# Altium project openEPS.PrjPcb (part 3 of 5)

## Sheet TPS53319 5.0V Buck Converter.SchDoc
size Letter; Organization: Altium Limited; Address1: L3, 12a Rodborough Rd; Address2: Frenchs Forest; Address3: NSW; Address4: Australia 2086; CopyrightYear: 2019
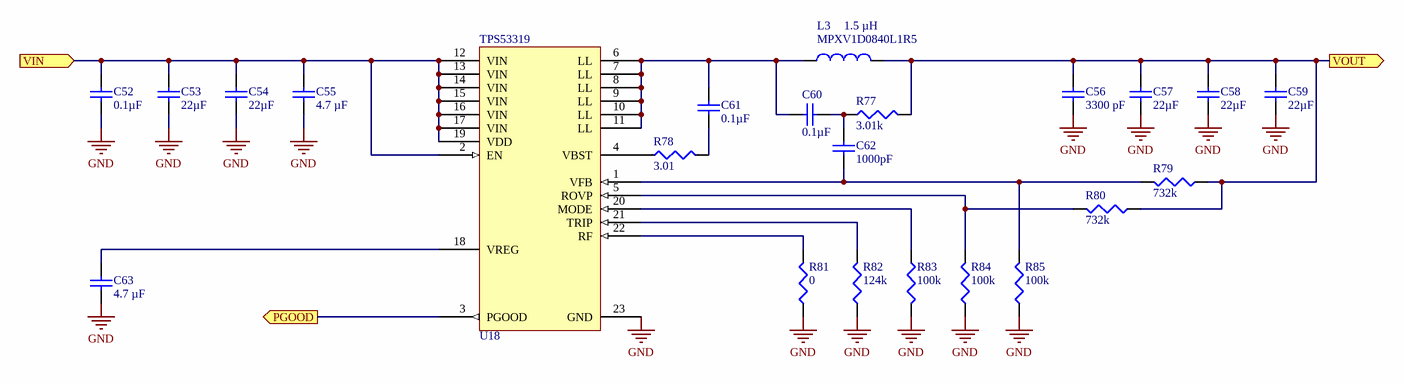
[diagram p10: TPS53319 5.0V Buck Converter.SchDoc]

### Parts
C52  value 0.1µF  [TY-TWK107]  (hidden comment: Cap)
C53  value 22µF  [TDK-C3225]  (hidden comment: Cap)
C54  value 22µF  [TDK-C3225]  (hidden comment: Cap)
C55  value 4.7 µF  [MUR-GRM188]  (hidden comment: Cap)
C56  value 3300 pF  [KEM-0402BB]  (hidden comment: Cap)
C57  value 22µF  [TDK-C3225]  (hidden comment: Cap)
C58  value 22µF  [TDK-C3225]  (hidden comment: Cap)
C59  value 22µF  [TDK-C3225]  (hidden comment: Cap)
C60  value 0.1µF  [TY-TWK107]  (hidden comment: Cap)
C61  value 0.1µF  [TY-TWK107]  (hidden comment: Cap)
C62  value 1000pF  [TDK-CGA2B]  (hidden comment: Cap)
C63  value 4.7 µF  [MUR-GRM188]  (hidden comment: Cap)
L3  value 1.5 µH  Manufacturer Part Number: MPXV1D0840L1R5  [KEM-MPXV1D0840]  (hidden comment: Inductor)
R77  value 3.01k  [VSH-CRCW0201]  (hidden comment: Res3)
R78  value 3.01  [VSH-CRCW0201]  (hidden comment: Res3)
R79  value 732k  [PANA-ERJ2R]  (hidden comment: Res3)
R80  value 732k  [PANA-ERJ2R]  (hidden comment: Res3)
R81  value 0  [PANA-ERJ2G]  (hidden comment: Jumper)
R82  value 124k  [PANA-ERJ2R]  (hidden comment: Res3)
R83  value 100k  [PANA-ERJ2R]  (hidden comment: Res3)
R84  value 100k  [PANA-ERJ2R]  (hidden comment: Res3)
R85  value 100k  [PANA-ERJ2R]  (hidden comment: Res3)
U18  TPS53319  [TI-R-PSON-N22]

### Ports
PGOOD (out), VIN (in), VOUT (out)

### Nets
GND: C52.1 C53.1 C54.1 C55.1 C56.1 C57.1 C58.1 C59.1 C63.1 R81.1 R82.1 R83.1 R84.1 R85.1 U18.23(GND)
VBATT_BUS: C52.2 C53.2 C54.2 C55.2 U18.2(EN) U18.12(VIN) U18.13(VIN) U18.14(VIN) U18.15(VIN) U18.16(VIN) U18.17(VIN) U18.19(VDD) ; port VIN
NetC56_2: C56.2 C57.2 C58.2 C59.2 L3.2 R77.2 R79.1 R80.1 ; port VOUT
NetC60_1: C60.1 C62.1 R77.1
NetC60_2: C60.2 C61.2 L3.1 U18.6(LL) U18.7(LL) U18.8(LL) U18.9(LL) U18.10(LL) U18.11(LL)
NetC61_1: C61.1 R78.2
NetC62_2: C62.2 R79.2 R85.2 U18.1(VFB)
NetC63_2: C63.2 U18.18(VREG)
NetR52_1: U18.3(PGOOD) ; port PGOOD
NetR78_1: R78.1 U18.4(VBST)
NetR80_2: R80.2 R84.2 U18.5(ROVP)
NetR81_2: R81.2 U18.22(RF)
NetR82_2: R82.2 U18.21(TRIP)
NetR83_2: R83.2 U18.20(MODE)

### Notes on the sheet
- (the "License"); you may not use or redistribute this file except in compliance with the License. You
- This file and the information within it are licensed under the terms of the Apache License, Version 2.0
- Copyright
- Unless required by applicable law or agreed to in writing, content distributed under the License is
- distributed on an "AS IS" BASIS, WITHOUT WARRANTIES OR CONDITIONS OF ANY KIND,
- either express or implied. See the License for the specific language governing permissions and
- limitations under the License.
- may obtain a copy of the License at:
- http://www.apache.org/licenses/LICENSE-2.0
- Title
- Size:
- Date:
- Letter
- Number:
- Time:
- Revision:
- Sheet
- of
- University of Alberta
- Deptartment of Electrical
- and Computer Engineering
- Edmonton AB, Canada
- T6G 1H9
- File:

### Library data of the parts
C52 C60 C61 = PC-TY-00817: CAP CER 0.1UF 25V X7R 0306; Manufacturer Part Number: TWK107B7104MVHT; Index: 817; Designator: C?; Tolerance: ±20%; Published: 2022-12-10; LatestRevisionDate: 2022-12-10; LatestRevisionNote: ...; PackageReference: 0306 (0816 Metric); Publisher: AlbertaSat; PackageDescription: Chip Capacitor, 2-Leads, Body 0.80x1.60mm, IPC Low Density; Part Number: PC-TY-00817; Supplier Part Number 1: 587-6181-1-ND; Supplier 1: Digi-key; Supplier Part Number 2: 963-TWK107B7104MVHT; Supplier 2: Mouser; Supplier Link: #https://www.digikey.ca/en/products/detail/taiyo-yuden/TWK107B7104MVHT/7403736#; Voltage-Rated: 25V; Temperature Coefficient: X7R; Application: Automotive; Operating Temperature: -55°C ~ 125°C
C53 C54 C57-C59 = PC-TDK-02965: CAP CER 22UF 25V X7R 1210; Manufacturer Part Number: C3225X7R1E226M250AB; Index: 2965; Designator: C?; Tolerance: ±20%; Code_IEC: 3225; Published: 2022-10-26; LatestRevisionDate: 2022-10-26; LatestRevisionNote: ...; PackageReference: 1210 (3225 Metric); Publisher: AlbertaSat; PackageDescription: Chip Capacitor, 2-Leads, Body 3.20x2.50mm, IPC Low Density; Part Number: PC-TDK-02965; Supplier Part Number 1: 445-181602-1-ND; Supplier 1: Digi-key; Supplier Part Number 2: 810-C3225X7R1EM250AB; Supplier 2: Mouser; Supplier Link: #https://www.digikey.ca/en/products/detail/tdk-corporation/C3225X7R1E226M250AB/9991387#; Voltage - Rated: 25V; Temperature Coefficient: X7R; Applications: General Purpose; Code_JEITA: 1210; Operating Temperature: -55°C ~ 125°C
C55 C63 = 10165: CAP CER 4.7UF 16V X7R 0603; Part Number: 10165; Manufacturer Part Number: GRM188Z71C475KE21D; Designator: C?; Tolerance: ±10%; Voltage - Rated: 25V; Published: 8-Jun-2000; LatestRevisionDate: 17-Jul-2002; LatestRevisionNote: Re-released for DXP Platform.; PackageReference: 0603 (1608 Metric); Publisher: Altium Limited; PackageDescription: Chip Capacitor, 2-Leads, Body 1.60x0.80mm, IPC Low Density; Supplier Part Number 1: 490-GRM188Z71C475KE21DCT-ND; Supplier 1: Digi-Key; Supplier Link: #https://www.digikey.ca/en/products/detail/murata-electronics/GRM188Z71C475KE21D/13401930#; Temperature Coefficient: X7R; Application: General Purpose; Operating Temperature: -55°C ~ 125°C; Supplier 2: Mouser; Supplier Part Number 2: 81-GRM188Z71C475KE1D
C56 = PC-KEM-03166: CAP CER 3300PF 50V X7R 0402; Manufacturer Part Number: C0402C332K5RAC7867; Index: 3166; Designator: C?; Tolerance: ±10%; Published: 2022-10-26; LatestRevisionDate: 2023-05-04; LatestRevisionNote: Added operating temperature; PackageReference: 0402 (1005 Metric); Publisher: AlbertaSat; PackageDescription: Chip Capacitor, 2-Leads, Body 1.00x0.50mm, IPC Low Density; Part Number: PC-KEM-03166; Supplier Part Number 1: 399-C0402C332K5RAC7867CT-ND; Supplier 1: Digi-key; Supplier Part Number 2: 80-C0402C332K5RAC; Supplier 2: Mouser; Supplier Link: #https://www.digikey.ca/en/products/detail/kemet/C0402C332K5RAC7867/501972?s=N4IgTCBcDaIMwE4EFoDCAGALOsq5zAGkBWAJQEFUB2ADgDYrUAVZAOQBEQBdAXyA#; Voltage - Rated: 50V; Temperature Coefficient: X7R; Applications: Bypass, Decoupling; Operating Temperature: -55°C ~ 125°C
C62 = PC-TDK-01454: CAP CER 1000PF 100V C0G 0402; Manufacturer Part Number: CGA2B1C0G2A102J050BC; Index: 1454; Designator: C?; Tolerance: ±5%; Temperature Coefficient: NP0; Published: 2016-03-16; LatestRevisionDate: 2016-03-16; LatestRevisionNote: ...; PackageReference: 0402 (1005 Metric); Publisher: AlbertaSat; PackageDescription: Radial Cap, Thru-Hole; 2 Leads; 0.3 in Pin Spacing; Part Number: PC-TDK-01454; Supplier Part Number 1: 445-172682-1-ND; Supplier 1: Digi-key; Supplier Link: http://www.digikey.ca/product-search/en?keywords=445-172682-1-ND; Voltage - Rated: 100V; Applications: Automotive; Operating Temperature: -55°C ~ 125°C
L3 = PL-KEM-03165: FIXED IND 1.5UH 16.2A 6.8MOHM SM; Code_IEC: 1005; Index: 3165; Designator: L?; Tolerance: ±20%; Published: 2022-10-26; LatestRevisionDate: 2023-05-04; LatestRevisionNote: Added operating temperature; PackageReference: 0.341" L x 0.315" W (8.65mm x 8.00mm); Publisher: AlbertaSat; PackageDescription: Precision Wire Wound Inductor, 2-Leads, Body 8.65x8.00mm, IPC Low Density; Code_JEITA: 0402; Part Number: PL-KEM-03165; Supplier Part Number 1: 399-MPXV1D0840L1R5CT-ND; Supplier 1: Digi-key; Supplier Part Number 2: 80-MPXV1D0840L1R5; Supplier 2: Mouser; Supplier Link: #https://www.digikey.ca/en/products/detail/kemet/MPXV1D0840L1R5/11314594?s=N4IgTCBcDaILIAUAaA1AjAEQAwA4AsWAMmgEoCsIAugL5A#; Operating Temperature: -55°C ~ 155°C
R77 = PR-VSH-00325: RES SMD 3.01K OHM 1% 1/20W 0201; Manufacturer Part Number: CRCW02013K01FKED; Index: 325; Designator: R?; Power - Rated: 0.05W, 1/20W; Temperature Coefficient: ±100ppm/°C; Published: 2022-12-11; LatestRevisionDate: 2022-12-11; LatestRevisionNote: ...; PackageReference: 0201 (0603 Metric); Publisher: AlbertaSat; PackageDescription: Chip Resistor, 2-Leads, Body 0.60x0.30mm, IPC Low Density; Part Number: PR-VSH-00325; Supplier Part Number 1: 541-3.01KAABCT-ND; Supplier 1: Digi-key; Supplier Part Number 2: 71-CRCW02013K01FKED; Supplier 2: Mouser; Supplier Link: #https://www.digikey.ca/en/products/detail/vishay-dale/CRCW02013K01FKED/1968056#; Tolerance: ±1%; Operating Temperature: -55°C ~ 155°C
R78 = PR-VSH-00326: CRCW0201 - 200/+400 3R01 1% ET7; Manufacturer Part Number: CRCW02013R01FXED; Index: 326; Designator: R?; Power - Rated: 0.05W, 1/20W; Temperature Coefficient: -200/ +400ppm/°C; Published: 2022-12-11; LatestRevisionDate: 2022-12-11; LatestRevisionNote: ...; PackageReference: 0201 (0603 Metric); Publisher: AlbertaSat; PackageDescription: Chip Resistor, 2-Leads, Body 0.60x0.30mm, IPC Low Density; Part Number: PR-VSH-00326; Supplier Part Number 1: 541-CRCW02013R01FXEDCT-ND; Supplier 1: Digi-key; Supplier Part Number 2: CRCW02013R01FXED; Supplier 2: Avnet; Supplier Link: #https://www.digikey.ca/en/products/detail/vishay-dale/CRCW02013R01FXED/10458991#; Tolerance: ±1%; Operating Temperature: -55°C ~ 155°C
R79 R80 = 19585: RES SMD 732K OHM 1% 1/10W 0402; Part Number: 19585; Manufacturer Part Number: ERJ-2RKF7323X; Designator: R?; Power: 0.1W, 1/10W; Temperature Coefficient: ±100ppm/°C; Published: 8-Jun-2000; LatestRevisionDate: 29-May-2009; LatestRevisionNote: IPC-7351 Footprint Added.; PackageReference: 0402 (1005 Metric); Publisher: Altium Limited; PackageDescription: Chip Resistor, 2-Leads, Body 1.00x0.50mm, IPC Low Density; Supplier Part Number 1: P732KLCT-ND; Supplier 1: Digi-Key; Supplier Link: http://www.digikey.ca/product-search/en?keywords=P732KLCT-ND; Tolerance: ±1%; Operating Temperature: -55°C ~ 155°C
R81 = 13127: RES SMD 0.0OHM JUMPER 1/10W 0402; Part Number: 13127; Manufacturer Part Number: ERJ-2GE0R00X; Designator: R?; Power: 0.1W, 1/10W; PackageDescription: Chip Resistor, 2-Leads, Body 1.00x0.50mm, IPC Low Density; Supplier Part Number 1: P0.0JCT-ND; Supplier 1: Digi-Key; Supplier Link: http://www.digikey.ca/product-search/en?keywords=P0.0JCT-ND; PackageReference: 0402 (1005 Metric); Tolerance: Jumper; Temperature Coefficient: -; Type: Jumper; Operating Temperature: -55°C ~ 155°C; Supplier 2: Mouser; Supplier Part Number 2: 667-ERJ-2GE0R00X
R82 = 18840: RES SMD 124K OHM 1% 1/10W 0402; Part Number: 18840; Manufacturer Part Number: ERJ-2RKF1243X; Designator: R?; Power: 0.1W, 1/10W; Temperature Coefficient: ±100ppm/°C; Published: 8-Jun-2000; LatestRevisionDate: 29-May-2009; LatestRevisionNote: IPC-7351 Footprint Added.; PackageReference: 0402 (1005 Metric); Publisher: Altium Limited; PackageDescription: Chip Resistor, 2-Leads, Body 1.00x0.50mm, IPC Low Density; Supplier Part Number 1: P124KLCT-ND; Supplier 1: Digi-Key; Supplier Link: http://www.digikey.ca/product-search/en?keywords=P124KLCT-ND; Tolerance: ±1%; Operating Temperature: -55°C ~ 155°C
R83-R85 = 18739: as R74-R76 on sheet TPS53319 3.3V Buck Converter; Published: 8-Jun-2000; LatestRevisionDate: 29-May-2009; LatestRevisionNote: IPC-7351 Footprint Added.; PackageReference: 0402 (1005 Metric); Publisher: Altium Limited; PackageDescription: Chip Resistor, 2-Leads, Body 1.00x0.50mm, IPC Low Density; Supplier Part Number 1: P100KLCT-ND; Supplier 1: Digi-Key; Supplier Link: http://www.digikey.ca/product-search/en?keywords=P100KLCT-ND; Tolerance: ±1%; Operating Temperature: -55°C ~ 155°C
U18 = 145: IC REG BUCK ADJUSTABLE 14A 22SON; Part Number: 145; Designator: U?; Supplier Part Number 2: 595-TPS53319DQPT; Supplier 2: Mouser; Manufacturer Part Number: TPS53319DQPT; Supplier Part Number 1: 296-39410-1-ND; Supplier 1: Digi-Key; Supplier Link: #https://www.digikey.ca/en/products/detail/texas-instruments/TPS53319DQPT/3471186#; PackageReference: TI-R-PSON-N22; Operating Temperature: -40°C ~ 85°C (TA)

## Sheet MAX16998A Watchdog Circuit.SchDoc: Watchdog Circuit
size Letter; SheetNumber: 15
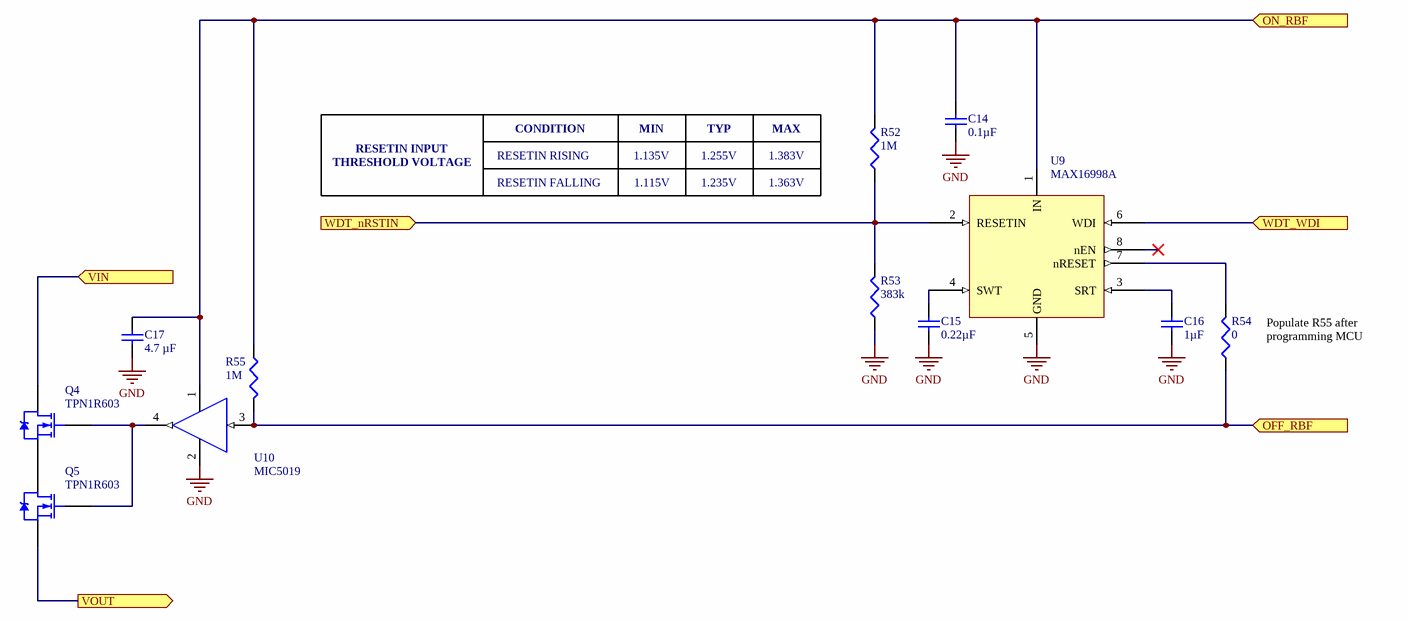
[diagram p11: MAX16998A Watchdog Circuit.SchDoc]

### Parts
C14  value 0.1µF  [TDK-CGA2B]  (hidden comment: Cap)
C15  value 0.22µF  [TDK-CGA3E]  (hidden comment: Cap)
C16  value 1µF  [TY-0603A]  (hidden comment: Cap)
C17  value 4.7 µF  [MUR-GRM188]  (hidden comment: Cap)
Q4  TPN1R603  [TOSH-S-3X1S]
Q5  TPN1R603  [TOSH-S-3X1S]
R52  value 1M  [PANA-ERJ2R]  (hidden comment: Res3)
R53  value 383k  [PANA-ERJ2R]  (hidden comment: Res3)
R54  value 0  [PANA-ERJ2G]  (hidden comment: Jumper)
R55  value 1M  [PANA-ERJ2R]  (hidden comment: Res3)
U9  MAX16998A  [MAX-21-0036]
U10  MIC5019  [MCP-MIC5019]

### Ports
OFF_RBF (in), ON_RBF (in), VIN (in), VOUT (out), WDT_nRSTIN (in), WDT_WDI (in)

### Nets
GND: C14.2 C15.1 C16.1 C17.1 R53.1 U9.5(GND) U10.2(GND)
VBATT: Q4.2(D) ; port VIN
VBATT_SWITCHED: Q5.3(S) ; port VOUT
GIO1: U9.6(WDI) ; port WDT_WDI
RBF_ALWAYSOFF: R54.1 R55.1 U10.3(IN) ; port OFF_RBF
RBF_ALWAYSON: C14.1 C17.2 R52.2 R55.2 U9.1(IN) U10.1(VDD) ; port ON_RBF
NetC15_2: C15.2 U9.4(SWT)
NetC16_2: C16.2 U9.3(SRT)
NetQ4_1: Q4.1(G) Q5.1(G) U10.4(OUT)
NetQ4_3: Q4.3(S) Q5.2(D)
NetR52_1: R52.1 R53.2 U9.2(RESETIN) ; port WDT_nRSTIN
NetR54_2: R54.2 U9.7(nRESET)

Not connected (* = marked no-connect by the designer): U9 8(nEN)*

### Notes on the sheet
- RESETIN INPUT
- THRESHOLD VOLTAGE
- RESETIN RISING
- CONDITION
- MIN
- 1.135V
- TYP
- 1.255V
- MAX
- 1.383V
- RESETIN FALLING
- 1.115V
- 1.235V
- 1.363V
- (near R54) Populate R55 after
- (near R54) programming MCU
- (the "License"); you may not use or redistribute this file except in compliance with the License. You
- This file and the information within it are licensed under the terms of the Apache License, Version 2.0
- Copyright
- Unless required by applicable law or agreed to in writing, content distributed under the License is
- distributed on an "AS IS" BASIS, WITHOUT WARRANTIES OR CONDITIONS OF ANY KIND,
- either express or implied. See the License for the specific language governing permissions and
- limitations under the License.
- may obtain a copy of the License at:
- http://www.apache.org/licenses/LICENSE-2.0
- Title
- Size:
- Date:
- Letter
- Number:
- Time:
- Revision:
- Sheet
- of
- University of Alberta
- Deptartment of Electrical
- and Computer Engineering
- Edmonton AB, Canada
- T6G 1H9
- File:

### Library data of the parts
C14 = PC-TDK-02259: CAP CER 0.1UF 50V X7R 0402; Manufacturer Part Number: CGA2B3X7R1H104K050BB; Index: 2259; Designator: C?; Tolerance: ±10%; Published: 2016-03-16; LatestRevisionDate: 2016-03-16; LatestRevisionNote: ...; PackageReference: 0402 (1005 Metric); Publisher: AlbertaSat; PackageDescription: Radial Cap, Thru-Hole; 2 Leads; 0.3 in Pin Spacing; Part Number: PC-TDK-02259; Supplier Part Number 1: 445-6899-1-ND; Supplier 1: Digi-key; Supplier Link: http://www.digikey.ca/product-search/en?keywords=445-6899-1-ND; Voltage - Rated: 50V; Temperature Coefficient: X7R; Applications: Automotive; Operating Temperature: -55°C ~ 125°C
C15 = PC-TDK-02393: CAP CER 0.22UF 50V X7R 0603; Manufacturer Part Number: CGA3E3X7R1H224K080AB; Index: 2393; Designator: C?; Tolerance: ±10%; Published: 2016-03-16; LatestRevisionDate: 2016-03-16; LatestRevisionNote: ...; PackageReference: 0603 (1608 Metric); Publisher: AlbertaSat; PackageDescription: Radial Cap, Thru-Hole; 2 Leads; 0.3 in Pin Spacing; Part Number: PC-TDK-02393; Supplier Part Number 1: 445-6926-1-ND; Supplier 1: Digi-key; Supplier Link: http://www.digikey.ca/product-search/en?keywords=445-6926-1-ND; Voltage - Rated: 50V; Temperature Coefficient: X7R; Applications: Automotive; Operating Temperature: -55°C ~ 125°C
C16 = PC-TY-00404: CAP CER 1UF 50V X7R 0603; Manufacturer Part Number: UMK107AB7105KA-T; Index: 404; Designator: C?; Tolerance: ±10%; Published: 2016-03-13; LatestRevisionDate: 2016-03-13; LatestRevisionNote: ...; PackageReference: 0603 (1608 Metric); Publisher: AlbertaSat; PackageDescription: Chip Capacitor, 2-Leads, Body 1.60x0.80mm, IPC Low Density; Part Number: PC-TY-00404; Supplier Part Number 1: 587-3247-1-ND; Supplier 1: Digi-key; Supplier Link: http://www.digikey.ca/product-search/en?keywords=587-3247-1-ND; Voltage-Rated: 50V; Temperature Coefficient: X7R; Application: General Purpose; Operating Temperature: -55°C ~ 125°C
C17 = 10165: as C55 on sheet TPS53319 5.0V Buck Converter; Published: 8-Jun-2000; LatestRevisionDate: 17-Jul-2002; LatestRevisionNote: Re-released for DXP Platform.; PackageReference: 0603 (1608 Metric); Publisher: Altium Limited; PackageDescription: Chip Capacitor, 2-Leads, Body 1.60x0.80mm, IPC Low Density; Supplier Part Number 1: 490-GRM188Z71C475KE21DCT-ND; Supplier 1: Digi-Key; Supplier Link: #https://www.digikey.ca/en/products/detail/murata-electronics/GRM188Z71C475KE21D/13401930#; Temperature Coefficient: X7R; Application: General Purpose; Operating Temperature: -55°C ~ 125°C; Supplier 2: Mouser; Supplier Part Number 2: 81-GRM188Z71C475KE1D
Q4 Q5 = PU-TOSH-00002: X35 PB-F POWER MOSFET TRANSISTOR; Index: 2; Designator: Q?; Rds On: 1.6mOhm @ 40A, 10V; Part Number: PU-TOSH-00002; Manufacturer Part Number: TPN1R603PL,L1Q; Supplier Part Number 1: TPN1R603PLL1QCT-ND; Supplier 1: Digi-key; Supplier Part Number 2: 757-TPN1R603PLL1Q; Supplier 2: Mouser; Publisher: AlbertaSat; Published: 2020-04-01; LatestRevisionDate: 2020-04-01; LatestRevisionNote: ...; PackageReference: 8-TSON Advance (3.3x3.3); PackageDescription: SON, 8-Leads, Body 3.10x3.10mm, Pitch 0.65mm, Thermal Pad 2.49x2.06mm, IPC Low Density; Supplier Link: #https://www.digikey.ca/product-detail/en/toshiba-semiconductor-and-storage/TPN1R603PL-L1Q/TPN1R603PLL1QCT-ND/6570930#; Operating Temperature: -55°C ~ 175°C (TJ)
R52 R55 = 19704: RES SMD 1M OHM 1% 1/10W 0402; Part Number: 19704; Manufacturer Part Number: ERJ-2RKF1004X; Designator: R?; Power: 0.1W, 1/10W; Temperature Coefficient: ±100ppm/°C; Published: 8-Jun-2000; LatestRevisionDate: 29-May-2009; LatestRevisionNote: IPC-7351 Footprint Added.; PackageReference: 0402 (1005 Metric); Publisher: Altium Limited; PackageDescription: Chip Resistor, 2-Leads, Body 1.00x0.50mm, IPC Low Density; Supplier Part Number 1: P1.00MLCT-ND; Supplier 1: Digi-Key; Supplier Link: http://www.digikey.ca/product-search/en?keywords=P1.00MLCT-ND; Tolerance: ±1%; Operating Temperature: -55°C ~ 155°C
R53 = 19322: RES SMD 383K OHM 1% 1/10W 0402; Part Number: 19322; Manufacturer Part Number: ERJ-2RKF3833X; Designator: R?; Power: 0.1W, 1/10W; Temperature Coefficient: ±100ppm/°C; Published: 8-Jun-2000; LatestRevisionDate: 29-May-2009; LatestRevisionNote: IPC-7351 Footprint Added.; PackageReference: 0402 (1005 Metric); Publisher: Altium Limited; PackageDescription: Chip Resistor, 2-Leads, Body 1.00x0.50mm, IPC Low Density; Supplier Part Number 1: P383KLCT-ND; Supplier 1: Digi-Key; Supplier Link: http://www.digikey.ca/product-search/en?keywords=P383KLCT-ND; Tolerance: ±1%; Operating Temperature: -55°C ~ 155°C
R54 = 13127: as R81 on sheet TPS53319 5.0V Buck Converter; PackageDescription: Chip Resistor, 2-Leads, Body 1.00x0.50mm, IPC Low Density; Supplier Part Number 1: P0.0JCT-ND; Supplier 1: Digi-Key; Supplier Link: http://www.digikey.ca/product-search/en?keywords=P0.0JCT-ND; PackageReference: 0402 (1005 Metric); Tolerance: Jumper; Temperature Coefficient: -; Type: Jumper; Operating Temperature: -55°C ~ 155°C; Supplier 2: Mouser; Supplier Part Number 2: 667-ERJ-2GE0R00X
U9 = PU-MAX-00002: IC TIMER WATCHDOG 8UMAX; Manufacturer Part Number: MAX16998AAUA/V+; Index: 2; Designator: U?; Part Number: PU-MAX-00002; Supplier Part Number 1: MAX16998AAUA/V+-ND; Supplier 1: Digi-key; Supplier Part Number 2: 700-MAX16998AAUA/V+; Supplier 2: Mouser; Publisher: AlbertaSat; Published: 2017-04-06; LatestRevisionDate: 2023-05-04; LatestRevisionNote: Added operating temperature; PackageReference: 8-uMAX; PackageDescription: TSOP, 8-Leads, Body 3.00x3.00mm, Pitch 0.65mm, IPC Low Density; Supplier Link: https://www.digikey.ca/product-search/en?keywords=MAX16998AAUA/V+-ND; Applications: Automotive; Operating Temperature: -40°C ~ 125°C (TA)
U10 = PU-MCP-00008: IC GATE DRVR HIGH-SIDE 4TQFN; Index: 8; Designator: U?; Part Number: PU-MCP-00008; Manufacturer Part Number: MIC5019YFT-TR; Supplier Part Number 1: 576-4152-1-ND; Supplier 1: Digi-key; Supplier Part Number 2: 998-MIC5019YFTTR; Supplier 2: Mouser; Publisher: AlbertaSat; Published: 2020-04-01; LatestRevisionDate: 2020-04-01; LatestRevisionNote: ...; PackageReference: 4-TQFN (1.2x1.2); Supplier Link: #https://www.digikey.ca/en/products/detail/microchip-technology/MIC5019YFT-TR/3681038#; Operating Temperature: -40°C ~ 125°C (TJ)

## Sheet RV-3032-C7 RTC.SchDoc: RTCMK RTC
size Letter; DocumentNumber: 8; SheetNumber: 8; SheetTotal: 19
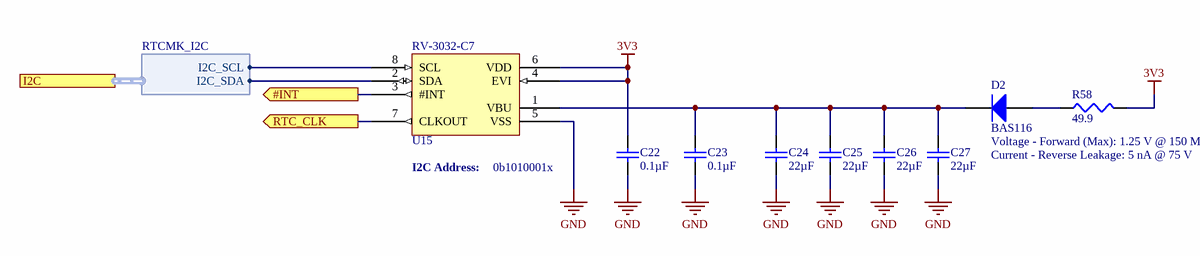
[diagram p12: RV-3032-C7 RTC.SchDoc]

### Parts
C22  value 0.1µF  [TDK-CGA2B]  (hidden comment: Cap)
C23  value 0.1µF  [TDK-CGA2B]  (hidden comment: Cap)
C24  value 22µF  [TY-1206L]  (hidden comment: Cap)
C25  value 22µF  [TY-1206L]  (hidden comment: Cap)
C26  value 22µF  [TY-1206L]  (hidden comment: Cap)
C27  value 22µF  [TY-1206L]  (hidden comment: Cap)
D2  BAS116  Voltage - Forward (Max): 1.25 V @ 150 Ma  Current - Reverse Leakage: 5 nA @ 75 V  [DIOD-DFN1006-2]
R58  value 49.9  [PANA-ERJ2R]  (hidden comment: Res3)
U15  RV-3032-C7  [MCS-RV-3032-C7]

### Ports
#INT (out), I2C (harness RTCMK_I2C), RTC_CLK (out)

### Harnesses
RTCMK_I2C: I2C_SCL, I2C_SDA

### Nets
3V3: C22.1 R58.2 U15.4(EVI) U15.6(VDD)
GND: C22.2 C23.2 C24.1 C25.1 C26.1 C27.1 U15.5(VSS)
GIO19: U15.3(#INT) ; port #INT
I2C0.I2C_SCL: U15.8(SCL) ; port I2C.I2C_SCL
I2C0.I2C_SDA: U15.2(SDA) ; port I2C.I2C_SDA
RTC_CLK: U15.7(CLKOUT) ; port RTC_CLK
NetC23_1: C23.1 C24.2 C25.2 C26.2 C27.2 D2.2(K) U15.1(VBU)
NetD2_1: D2.1(A) R58.1

### Notes on the sheet
- (near U15) I2C Address:
- (near U15) 0b1010001x
- (the "License"); you may not use or redistribute this file except in compliance with the License. You
- This file and the information within it are licensed under the terms of the Apache License, Version 2.0
- Copyright
- Unless required by applicable law or agreed to in writing, content distributed under the License is
- distributed on an "AS IS" BASIS, WITHOUT WARRANTIES OR CONDITIONS OF ANY KIND,
- either express or implied. See the License for the specific language governing permissions and
- limitations under the License.
- may obtain a copy of the License at:
- http://www.apache.org/licenses/LICENSE-2.0
- Title
- Size:
- Date:
- Letter
- Number:
- Time:
- Revision:
- Sheet
- of
- University of Alberta
- Deptartment of Electrical
- and Computer Engineering
- Edmonton AB, Canada
- T6G 1H9
- File:

### Library data of the parts
C22 C23 = PC-TDK-02259: as C14 on sheet MAX16998A Watchdog Circuit; Published: 2016-03-16; LatestRevisionDate: 2016-03-16; LatestRevisionNote: ...; PackageReference: 0402 (1005 Metric); Publisher: AlbertaSat; PackageDescription: Radial Cap, Thru-Hole; 2 Leads; 0.3 in Pin Spacing; Part Number: PC-TDK-02259; Supplier Part Number 1: 445-6899-1-ND; Supplier 1: Digi-key; Supplier Link: http://www.digikey.ca/product-search/en?keywords=445-6899-1-ND; Voltage - Rated: 50V; Temperature Coefficient: X7R; Applications: Automotive; Operating Temperature: -55°C ~ 125°C
C24-C27 = PC-TY-00721: CAP CER 22UF 16V X7R 1206; Manufacturer Part Number: EMK316BB7226ML-T; Index: 721; Designator: C?; Tolerance: ±20%; Published: 2016-03-13; LatestRevisionDate: 2016-03-13; LatestRevisionNote: ...; PackageReference: 1206 (3216 Metric); Publisher: AlbertaSat; PackageDescription: Chip Capacitor, 2-Leads, Body 3.20x1.60mm, IPC Low Density; Part Number: PC-TY-00721; Supplier Part Number 1: 587-4319-1-ND; Supplier 1: Digi-key; Supplier Link: http://www.digikey.ca/product-search/en?keywords=587-4319-1-ND; Voltage-Rated: 16V; Temperature Coefficient: X7R; Application: General Purpose; Operating Temperature: -55°C ~ 125°C
D2 = 61: DIODE GEN PURP 85V 215MA 2DFN; Part Number: 61; Manufacturer Part Number: BAS116LPH4-7B; Designator: d?; Power - Peak Pulse: 300 mW; Published: 8-Jun-2000; LatestRevisionDate: 17-Jul-2002; LatestRevisionNote: Re-released for DXP Platform.; PackageVersion: Sep-1996; PackageReference: DFN1006; Publisher: Altium Limited; PackageDescription: DO-214-AB/SMC; 2 C-Bend Leads; Body 7.9 x 5.9 mm, inc. leads (LxW); Code_JEDEC: DO-214-AB; Supplier Part Number 1: BAS116LPH4-7BDICT-ND; Supplier 1: Digi-Key; Supplier Part Number 2: 621-BAS116LPH4-7B; Supplier 2: Mouser; Supplier Link: #https://www.digikey.ca/en/products/detail/diodes-incorporated/BAS116LPH4-7B/2755852#; Voltage - Breakdown (Min): 85V; Operating Temperature: -55°C ~ 150°C (TJ)
R58 = 13732: RES SMD 49.9 OHM 1% 1/10W 0402; Part Number: 13732; Manufacturer Part Number: ERJ-2RKF49R9X; Designator: R?; Power: 0.1W, 1/10W; Temperature Coefficient: ±100ppm/°C; Published: 8-Jun-2000; LatestRevisionDate: 29-May-2009; LatestRevisionNote: IPC-7351 Footprint Added.; PackageReference: 0402 (1005 Metric); Publisher: Altium Limited; PackageDescription: Chip Resistor, 2-Leads, Body 1.00x0.50mm, IPC Low Density; Supplier Part Number 1: P49.9LCT-ND; Supplier 1: Digi-Key; Supplier Link: http://www.digikey.ca/product-search/en?keywords=P49.9LCT-ND; Tolerance: ±1%; Operating Temperature: -55°C ~ 155°C
U15 = PU-MCS-00001: Real Time Clock (RTC) IC Clock/Calendar 16B, 32B I²C, 2-Wire Serial 8-WCDFN; Manufacturer Part Number: RV-3032-C7 32.768kHz-2.5PPM-TA-QA; Index: 1; Designator: U?; Time Format: HH:MM:SS:100th (24 hr); Current - Timekeeping (Max): 210nA @ 3V; Voltage - Supply: 1.3V ~ 5.5V; Part Number: PU-MCS-00001; Supplier Part Number 1: 2195-RV-3032-C7-32.768KHZ-2.5PPM-TA-QADKR-ND; Supplier 1: Digi-key; Supplier Part Number 2: 428-203853-MG01; Supplier 2: Mouser; Publisher: AlbertaSat; Published: 2023-04-13; LatestRevisionDate: 2023-04-13; LatestRevisionNote: ...; PackageReference: 8-SON (3.2x1.5); PackageDescription: 8-SON (3.2x1.5); Supplier Link: #https://www.digikey.ca/en/products/detail/micro-crystal-ag/RV-3032-C7-32-768KHZ-2-5PPM-TA-QA/16273065#; Operating Temperature: -40°C ~ 105°C (TA)

## Sheet INA226 Current Sensor.SchDoc: INA381A Overcurrent Protection
size Letter; SheetNumber: 21
Used 3 times, as channels U_INA226 Current Sensor1, U_INA226 Current Sensor2, U_INA226 Current Sensor3. Parts and nets are listed once, with the designators drawn on the sheet.
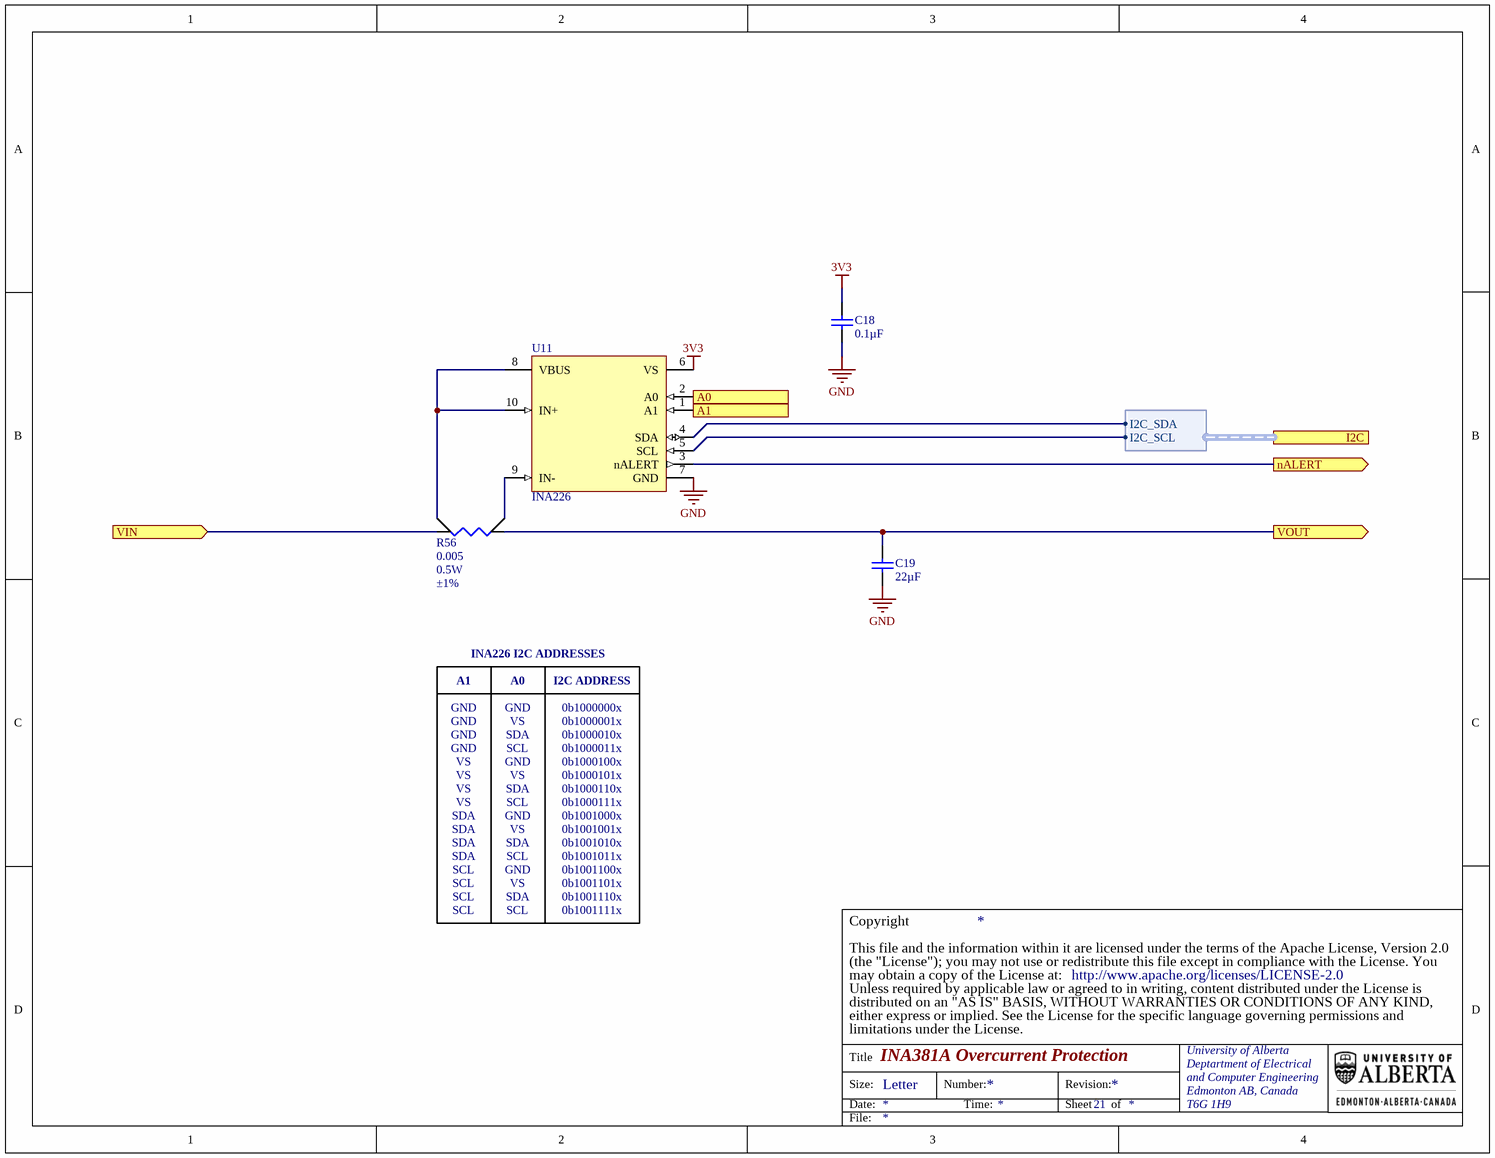
[diagram p13: INA226 Current Sensor.SchDoc]

### Parts
C18  value 0.1µF  [TDK-CGA2B]  (hidden comment: Cap)
C19  value 22µF  [TDK-C3225]  (hidden comment: Cap)
R56  value 0.005  Power - Rated: 0.5W  Tolerance: ±1%  [BRN-CRF0805]  (hidden comment: Res Sense)
U11  INA226  [TI-DGS]

### Ports
A0 (in), A1 (in), I2C (harness INA226_I2C), nALERT (out), VIN (in), VOUT (out)

### Harnesses
INA226_I2C: I2C_SCL, I2C_SDA

### Nets
3V3: C18.2 U11.6(VS)
GND: C18.1 C19.1 U11.7(GND)
A0: U11.2(A0) ; port A0
A1: U11.1(A1) ; port A1
nALERT: U11.3(nALERT) ; port nALERT
VIN: R56.2(I2) ; port VIN
VOUT: C19.2 R56.1(I1) ; port VOUT
NetR56_3: R56.3(S2) U11.8(VBUS) U11.10(IN+)
NetR56_4: R56.4(S1) U11.9(IN-)
NetU11_4: U11.4(SDA) ; port I2C.I2C_SDA
NetU11_5: U11.5(SCL) ; port I2C.I2C_SCL

### Channels
U_INA226 Current Sensor1: designators end in _1; ports A0=3V3 A1=I2C0.I2C_SCL nALERT=NetU11_1_3 VIN=NetC44_2 VOUT=3V3IN
U_INA226 Current Sensor2: designators end in _2; ports A0=I2C0.I2C_SDA A1=I2C0.I2C_SCL nALERT=NetU11_2_3 VIN=NetC32_2 VOUT=1V2IN
U_INA226 Current Sensor3: designators end in _3; ports A0=I2C0.I2C_SCL A1=I2C0.I2C_SCL nALERT=NetU11_3_3 VIN=NetC56_2 VOUT=5V0IN

### Notes on the sheet
- A1
- GND
- A0
- INA226 I2C ADDRESSES
- I2C ADDRESS
- 0b1000000x
- VS
- SDA
- SCL
- 0b1000001x
- 0b1000010x
- 0b1000011x
- 0b1000100x
- 0b1000101x
- 0b1000110x
- 0b1000111x
- 0b1001000x
- 0b1001001x
- 0b1001010x
- 0b1001011x
- 0b1001100x
- 0b1001101x
- 0b1001110x
- 0b1001111x
- (the "License"); you may not use or redistribute this file except in compliance with the License. You
- This file and the information within it are licensed under the terms of the Apache License, Version 2.0
- Copyright
- Unless required by applicable law or agreed to in writing, content distributed under the License is
- distributed on an "AS IS" BASIS, WITHOUT WARRANTIES OR CONDITIONS OF ANY KIND,
- either express or implied. See the License for the specific language governing permissions and
- limitations under the License.
- may obtain a copy of the License at:
- http://www.apache.org/licenses/LICENSE-2.0
- Title
- Size:
- Date:
- Letter
- Number:
- Time:
- Revision:
- Sheet
- of
- University of Alberta
- Deptartment of Electrical
- and Computer Engineering
- Edmonton AB, Canada
- T6G 1H9
- File:

### Library data of the parts
C18 = PC-TDK-02259: as C14 on sheet MAX16998A Watchdog Circuit; Published: 2016-03-16; LatestRevisionDate: 2016-03-16; LatestRevisionNote: ...; PackageReference: 0402 (1005 Metric); Publisher: AlbertaSat; PackageDescription: Radial Cap, Thru-Hole; 2 Leads; 0.3 in Pin Spacing; Part Number: PC-TDK-02259; Supplier Part Number 1: 445-6899-1-ND; Supplier 1: Digi-key; Supplier Link: http://www.digikey.ca/product-search/en?keywords=445-6899-1-ND; Voltage - Rated: 50V; Temperature Coefficient: X7R; Applications: Automotive; Operating Temperature: -55°C ~ 125°C
C19 = PC-TDK-02965: as C53 on sheet TPS53319 5.0V Buck Converter; Published: 2022-10-26; LatestRevisionDate: 2022-10-26; LatestRevisionNote: ...; PackageReference: 1210 (3225 Metric); Publisher: AlbertaSat; PackageDescription: Chip Capacitor, 2-Leads, Body 3.20x2.50mm, IPC Low Density; Part Number: PC-TDK-02965; Supplier Part Number 1: 445-181602-1-ND; Supplier 1: Digi-key; Supplier Part Number 2: 810-C3225X7R1EM250AB; Supplier 2: Mouser; Supplier Link: #https://www.digikey.ca/en/products/detail/tdk-corporation/C3225X7R1E226M250AB/9991387#; Voltage - Rated: 25V; Temperature Coefficient: X7R; Applications: General Purpose; Code_JEITA: 1210; Operating Temperature: -55°C ~ 125°C
R56 = PR-BRN-00023: RES 0.005 OHM 1% 1/2W 0805; Manufacturer Part Number: CRF0805-FZ-R005ELF; Index: 23; Designator: R?; Temperature Coefficient: ±50ppm/°C; Part Number: PR-BRN-00023; Supplier Part Number 1: CRF0805-FZ-R005ELFCT-ND; Supplier 1: Digi-key; Supplier Part Number 2: 652-CRF0805FZR005ELF; Supplier 2: Mouser; Publisher: AlbertaSat; Published: 2022-11-26; LatestRevisionDate: 2023-05-04; LatestRevisionNote: Added operating temperature; PackageReference: BRN-CRF0805; Supplier Link: #https://www.digikey.ca/en/products/detail/bourns-inc/CRF0805-FZ-R005ELF/6210977#; Operating Temperature: -55°C ~ 170°C
U11 = 19: IC MONITOR PWR/CURR BIDIR 10MSOP; Part Number: 19; Manufacturer Part Number: INA226AQDGSRQ1; Designator: U?; Supplier Part Number 2: 595-INA226AQDGSRQ1; Supplier 2: Mouser; Supplier Part Number 1: 296-42503-1-ND; Supplier 1: Digi-Key; Supplier Link: #https://www.digikey.com/product-detail/en/texas-instruments/INA226AQDGSRQ1/296-42503-1-ND/5416001#; PackageReference: TI-MSOP10; Operating Temperature: -40°C ~ 125°C

## Sheet TCA9548A Solar Panel I2C Multiplexer.SchDoc
size Letter
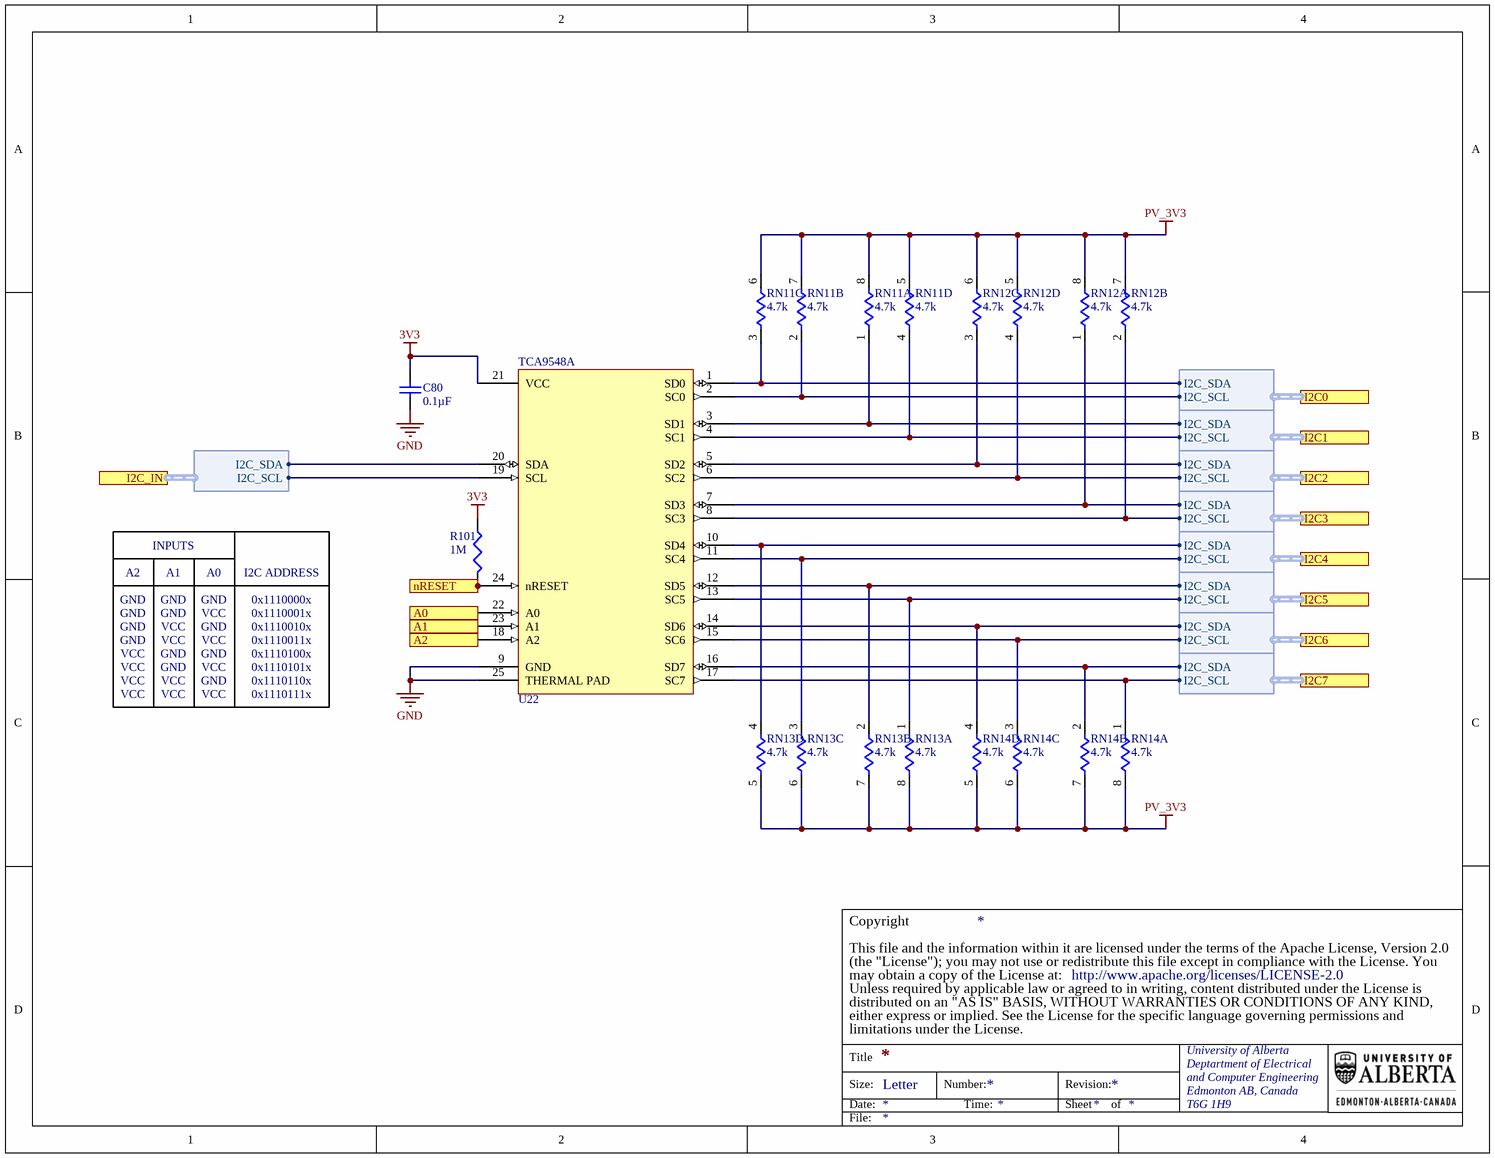
[diagram p14: TCA9548A Solar Panel I2C Multiplexer.SchDoc]

### Parts
C80  value 0.1µF  [TDK-CGA2B]  (hidden comment: Cap)
R101  value 1M  [PANA-ERJ2R]  (hidden comment: Res3)
RN11  value 4.7k  [PANA-EXB28V]  (hidden comment: Res4 Pack1)  (parts A,B,C,D of 4)
RN12  value 4.7k  [PANA-EXB28V]  (hidden comment: Res4 Pack1)  (parts A,B,C,D of 4)
RN13  value 4.7k  [PANA-EXB28V]  (hidden comment: Res4 Pack1)  (parts A,B,C,D of 4)
RN14  value 4.7k  [PANA-EXB28V]  (hidden comment: Res4 Pack1)  (parts A,B,C,D of 4)
U22  TCA9548A  [TI-RGE0024H]

### Ports
A0 (in), A1 (in), A2 (in), I2C0 (harness TCA9548A_I2C0), I2C1 (harness TCA9548A_I2C1), I2C2 (harness TCA9548A_I2C2), I2C3 (harness TCA9548A_I2C3), I2C4 (harness TCA9548A_I2C4), I2C5 (harness TCA9548A_I2C5), I2C6 (harness TCA9548A_I2C6), I2C7 (harness TCA9548A_I2C7), I2C_IN (harness TCA9548A_I2CIN), nRESET (in)

### Harnesses
TCA9548A_I2C1: I2C_SCL, I2C_SDA
TCA9548A_I2C2: I2C_SCL, I2C_SDA
TCA9548A_I2C3: I2C_SCL, I2C_SDA
TCA9548A_I2C4: I2C_SCL, I2C_SDA
TCA9548A_I2C5: I2C_SCL, I2C_SDA
TCA9548A_I2C6: I2C_SCL, I2C_SDA
TCA9548A_I2C7: I2C_SCL, I2C_SDA
TCA9548A_I2CIN: I2C_SCL, I2C_SDA
TCA9548A_I2C0: I2C_SCL, I2C_SDA

### Nets
3V3: C80.1 R101.2 U22.21(VCC)
GND: C80.2 U22.9(GND) U22.18(A2) U22.22(A0) U22.23(A1) U22.25(THERMAL_PAD) ; port A0, port A1, port A2
PV_3V3: RN11.5 RN11.6 RN11.7 RN11.8 RN12.5 RN12.6 RN12.7 RN12.8 RN13.5 RN13.6 RN13.7 RN13.8 RN14.5 RN14.6 RN14.7 RN14.8
GIO23: R101.1 U22.24(nRESET) ; port nRESET
I2C_SCL: U22.19(SCL) ; port I2C_IN.I2C_SCL
I2C_SDA: U22.20(SDA) ; port I2C_IN.I2C_SDA
PV_SCL1: RN11.3 U22.1(SD0) ; port I2C0.I2C_SDA
PV_SCL2: RN11.1 U22.3(SD1) ; port I2C1.I2C_SDA
PV_SCL3: RN12.3 U22.5(SD2) ; port I2C2.I2C_SDA
PV_SCL4: RN12.1 U22.7(SD3) ; port I2C3.I2C_SDA
PV_SCL5: RN13.4 U22.10(SD4) ; port I2C4.I2C_SDA
PV_SCL6: RN13.2 U22.12(SD5) ; port I2C5.I2C_SDA
PV_SCL7: RN14.4 U22.14(SD6) ; port I2C6.I2C_SDA
PV_SCL8: RN14.2 U22.16(SD7) ; port I2C7.I2C_SDA
PV_SDA1: RN11.2 U22.2(SC0) ; port I2C0.I2C_SCL
PV_SDA2: RN11.4 U22.4(SC1) ; port I2C1.I2C_SCL
PV_SDA3: RN12.4 U22.6(SC2) ; port I2C2.I2C_SCL
PV_SDA4: RN12.2 U22.8(SC3) ; port I2C3.I2C_SCL
PV_SDA5: RN13.3 U22.11(SC4) ; port I2C4.I2C_SCL
PV_SDA6: RN13.1 U22.13(SC5) ; port I2C5.I2C_SCL
PV_SDA7: RN14.3 U22.15(SC6) ; port I2C6.I2C_SCL
PV_SDA8: RN14.1 U22.17(SC7) ; port I2C7.I2C_SCL

### Notes on the sheet
- A2
- INPUTS
- A1
- A0
- I2C ADDRESS
- GND
- VCC
- 0x1110000x
- 0x1110001x
- 0x1110010x
- 0x1110011x
- 0x1110100x
- 0x1110101x
- 0x1110110x
- 0x1110111x
- (the "License"); you may not use or redistribute this file except in compliance with the License. You
- This file and the information within it are licensed under the terms of the Apache License, Version 2.0
- Copyright
- Unless required by applicable law or agreed to in writing, content distributed under the License is
- distributed on an "AS IS" BASIS, WITHOUT WARRANTIES OR CONDITIONS OF ANY KIND,
- either express or implied. See the License for the specific language governing permissions and
- limitations under the License.
- may obtain a copy of the License at:
- http://www.apache.org/licenses/LICENSE-2.0
- Title
- Size:
- Date:
- Letter
- Number:
- Time:
- Revision:
- Sheet
- of
- University of Alberta
- Deptartment of Electrical
- and Computer Engineering
- Edmonton AB, Canada
- T6G 1H9
- File:

### Library data of the parts
C80 = PC-TDK-02259: as C14 on sheet MAX16998A Watchdog Circuit; Published: 2016-03-16; LatestRevisionDate: 2016-03-16; LatestRevisionNote: ...; PackageReference: 0402 (1005 Metric); Publisher: AlbertaSat; PackageDescription: Radial Cap, Thru-Hole; 2 Leads; 0.3 in Pin Spacing; Part Number: PC-TDK-02259; Supplier Part Number 1: 445-6899-1-ND; Supplier 1: Digi-key; Supplier Link: http://www.digikey.ca/product-search/en?keywords=445-6899-1-ND; Voltage - Rated: 50V; Temperature Coefficient: X7R; Applications: Automotive; Operating Temperature: -55°C ~ 125°C
R101 = 19704: as R52 on sheet MAX16998A Watchdog Circuit; Published: 8-Jun-2000; LatestRevisionDate: 29-May-2009; LatestRevisionNote: IPC-7351 Footprint Added.; PackageReference: 0402 (1005 Metric); Publisher: Altium Limited; PackageDescription: Chip Resistor, 2-Leads, Body 1.00x0.50mm, IPC Low Density; Supplier Part Number 1: P1.00MLCT-ND; Supplier 1: Digi-Key; Supplier Link: http://www.digikey.ca/product-search/en?keywords=P1.00MLCT-ND; Tolerance: ±1%; Operating Temperature: -55°C ~ 155°C
RN11-RN14 = 19961: RES ARRAY 4 RES 4.7K OHM 0804; Part Number: 19961; Manufacturer Part Number: EXB-28V472JX; Sim Note: Enter the Resistance value into parameter field.; Designator: RN?; Tolerance: ±5%; Power: 62.5mW; Temperature Coefficient: ±200ppm/°C; Code_JEDEC: MS-012-AC; Supplier Part Number 1: Y7472CT-ND; Supplier 1: Digi-Key; Supplier Link: http://www.digikey.ca/product-search/en?keywords=Y7472CT-ND; PackageReference: 0804, Convex, Long Side Terminals
U22 = 159: IC BUS SWITCH 1 X 8:1 24VQFN; Part Number: 159; Designator: U?; Supplier Part Number 2: 595-TCA9548ARGERQ1; Supplier 2: Mouser; Manufacturer Part Number: TCA9548ARGERQ1; Supplier Part Number 1: 296-TCA9548ARGERQ1CT-ND; Supplier 1: Digi-Key; Supplier Link: #https://www.digikey.ca/en/products/detail/texas-instruments/TCA9548ARGERQ1/10434845#; PackageReference: 24-VFQFN Exposed Pad; Operating Temperature: -40°C ~ 85°C (TA)

## Sheet Solar Panel Connectors.SchDoc: PV Headers
size Letter; SheetNumber: 14
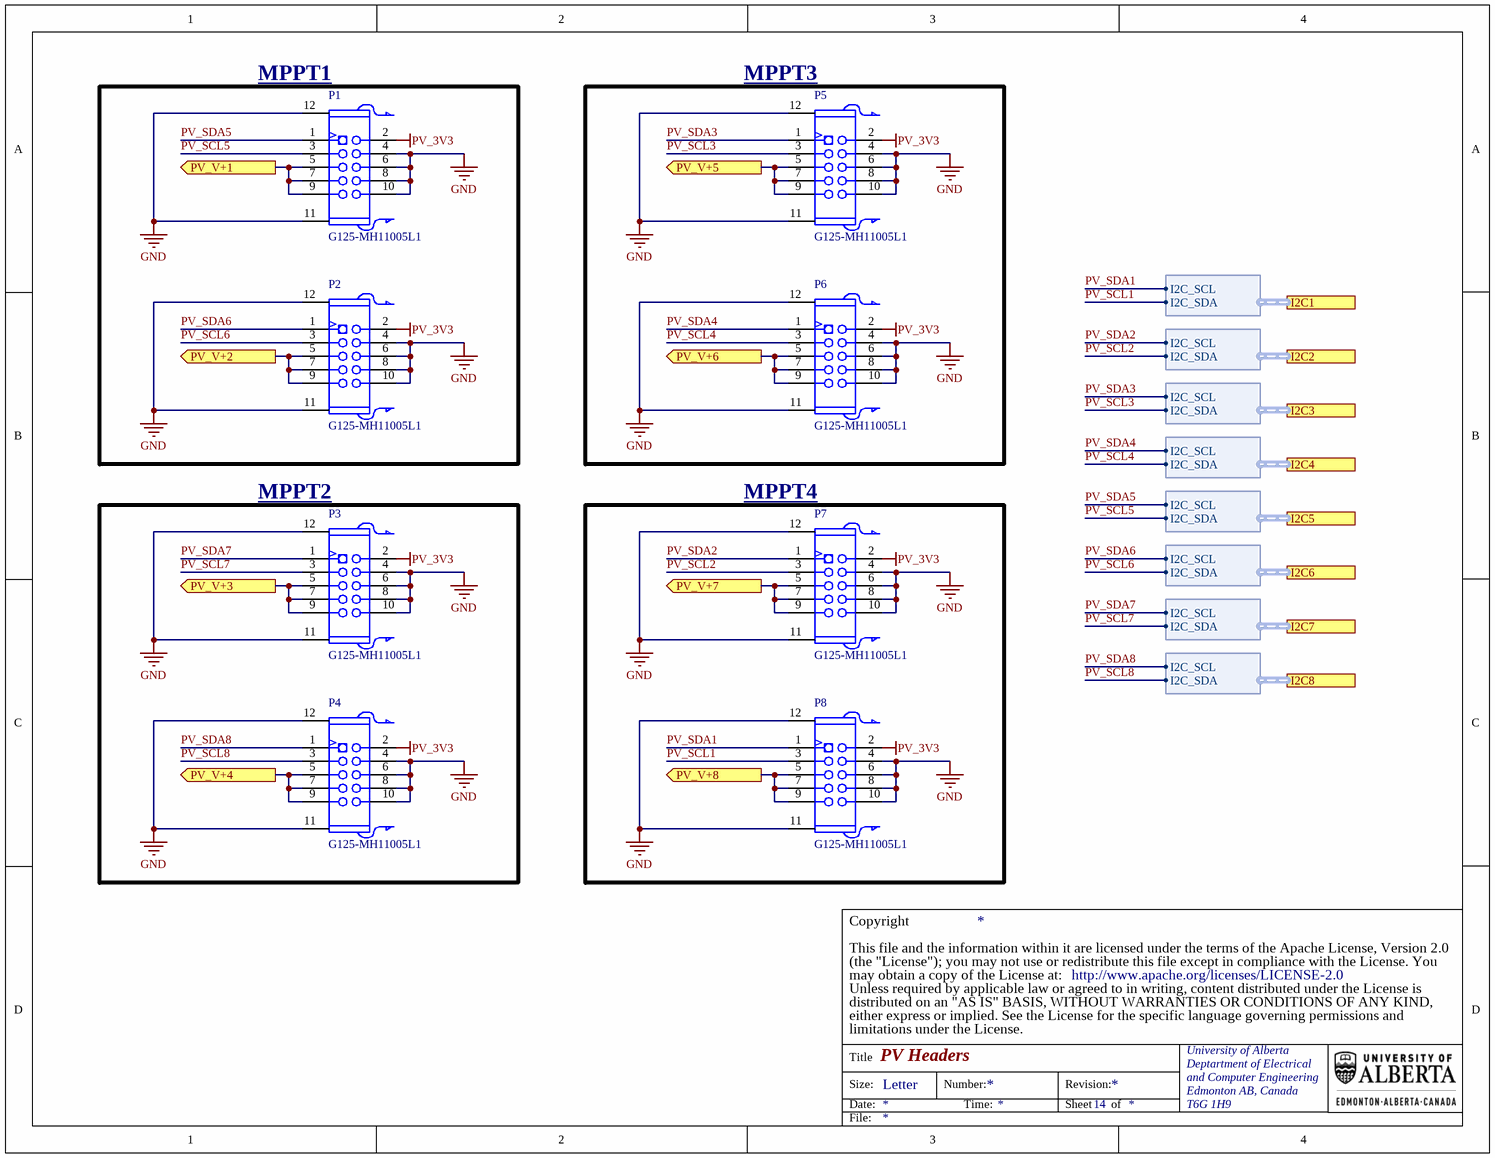
[diagram p15: Solar Panel Connectors.SchDoc]

### Parts
P1  G125-MH11005L1  [HWN-G125-MH11005L1]
P2  G125-MH11005L1  [HWN-G125-MH11005L1]
P3  G125-MH11005L1  [HWN-G125-MH11005L1]
P4  G125-MH11005L1  [HWN-G125-MH11005L1]
P5  G125-MH11005L1  [HWN-G125-MH11005L1]
P6  G125-MH11005L1  [HWN-G125-MH11005L1]
P7  G125-MH11005L1  [HWN-G125-MH11005L1]
P8  G125-MH11005L1  [HWN-G125-MH11005L1]

### Blocks framed on the sheet
MPPT1: P1 P2
MPPT3: P5 P6
MPPT2: P3 P4
MPPT4: P7 P8

### Ports
I2C1 (harness PV_I2C1), I2C2 (harness PV_I2C2), I2C3 (harness PV_I2C3), I2C4 (harness PV_I2C4), I2C5 (harness PV_I2C5), I2C6 (harness PV_I2C6), I2C7 (harness PV_I2C7), I2C8 (harness PV_I2C8), PV_V+1 (out), PV_V+2 (out), PV_V+3 (out), PV_V+4 (out), PV_V+5 (out), PV_V+6 (out), PV_V+7 (out), PV_V+8 (out)

### Harnesses
PV_I2C2: I2C_SCL, I2C_SDA
PV_I2C3: I2C_SCL, I2C_SDA
PV_I2C4: I2C_SCL, I2C_SDA
PV_I2C5: I2C_SCL, I2C_SDA
PV_I2C6: I2C_SCL, I2C_SDA
PV_I2C7: I2C_SCL, I2C_SDA
PV_I2C8: I2C_SCL, I2C_SDA
PV_I2C1: I2C_SCL, I2C_SDA

### Nets
GND: P1.4 P1.6 P1.8 P1.10 P1.11 P1.12 P2.4 P2.6 P2.8 P2.10 P2.11 P2.12 P3.4 P3.6 P3.8 P3.10 P3.11 P3.12 P4.4 P4.6 P4.8 P4.10 P4.11 P4.12 P5.4 P5.6 P5.8 P5.10 P5.11 P5.12 P6.4 P6.6 P6.8 P6.10 P6.11 P6.12 P7.4 P7.6 P7.8 P7.10 P7.11 P7.12 P8.4 P8.6 P8.8 P8.10 P8.11 P8.12
PV_3V3: P1.2 P2.2 P3.2 P4.2 P5.2 P6.2 P7.2 P8.2
PV_SCL1: P8.3 ; port I2C1.I2C_SDA
PV_SCL2: P7.3 ; port I2C2.I2C_SDA
PV_SCL3: P5.3 ; port I2C3.I2C_SDA
PV_SCL4: P6.3 ; port I2C4.I2C_SDA
PV_SCL5: P1.3 ; port I2C5.I2C_SDA
PV_SCL6: P2.3 ; port I2C6.I2C_SDA
PV_SCL7: P3.3 ; port I2C7.I2C_SDA
PV_SCL8: P4.3 ; port I2C8.I2C_SDA
PV_SDA1: P8.1 ; port I2C1.I2C_SCL
PV_SDA2: P7.1 ; port I2C2.I2C_SCL
PV_SDA3: P5.1 ; port I2C3.I2C_SCL
PV_SDA4: P6.1 ; port I2C4.I2C_SCL
PV_SDA5: P1.1 ; port I2C5.I2C_SCL
PV_SDA6: P2.1 ; port I2C6.I2C_SCL
PV_SDA7: P3.1 ; port I2C7.I2C_SCL
PV_SDA8: P4.1 ; port I2C8.I2C_SCL
NetP1_5: P1.5 P1.7 P1.9 ; port PV_V+1
NetP2_5: P2.5 P2.7 P2.9 ; port PV_V+2
NetP3_5: P3.5 P3.7 P3.9 ; port PV_V+3
NetP4_5: P4.5 P4.7 P4.9 ; port PV_V+4
NetP5_5: P5.5 P5.7 P5.9 ; port PV_V+5
NetP6_5: P6.5 P6.7 P6.9 ; port PV_V+6
NetP7_5: P7.5 P7.7 P7.9 ; port PV_V+7
NetP8_5: P8.5 P8.7 P8.9 ; port PV_V+8

### Notes on the sheet
- (the "License"); you may not use or redistribute this file except in compliance with the License. You
- This file and the information within it are licensed under the terms of the Apache License, Version 2.0
- Copyright
- Unless required by applicable law or agreed to in writing, content distributed under the License is
- distributed on an "AS IS" BASIS, WITHOUT WARRANTIES OR CONDITIONS OF ANY KIND,
- either express or implied. See the License for the specific language governing permissions and
- limitations under the License.
- may obtain a copy of the License at:
- http://www.apache.org/licenses/LICENSE-2.0
- Title
- Size:
- Date:
- Letter
- Number:
- Time:
- Revision:
- Sheet
- of
- University of Alberta
- Deptartment of Electrical
- and Computer Engineering
- Edmonton AB, Canada
- T6G 1H9
- File:

### Library data of the parts
P1-P8 = PP-HWN-00015: CONN HEADER R/A 10POS 1.25MM; Index: 15; Designator: P?; Part Number: PP-HWN-00015; Manufacturer Part Number: G125-MH11005L1P; Supplier Part Number 1: 952-2696-ND; Supplier 1: Digi-key; Supplier Part Number 2: 855-G125-MH11005L1P; Supplier 2: Mouser; Publisher: AlbertaSat; Published: 2019-07-08; LatestRevisionDate: 2023-05-04; LatestRevisionNote: Added operating temperature; Supplier Link: https://www.digikey.ca/products/en?keywords=952-2696-ND; Operating Temperature: -65°C ~ 150°C

## Sheet Solar Power Converter with MPPT.SchDoc: PV Boost Converter with MPPT
size Letter; SheetNumber: 10
Used 4 times, as channels U_Solar Power Converter with MPPT1, U_Solar Power Converter with MPPT2, U_Solar Power Converter with MPPT3, U_Solar Power Converter with MPPT4. Parts and nets are listed once, with the designators drawn on the sheet.
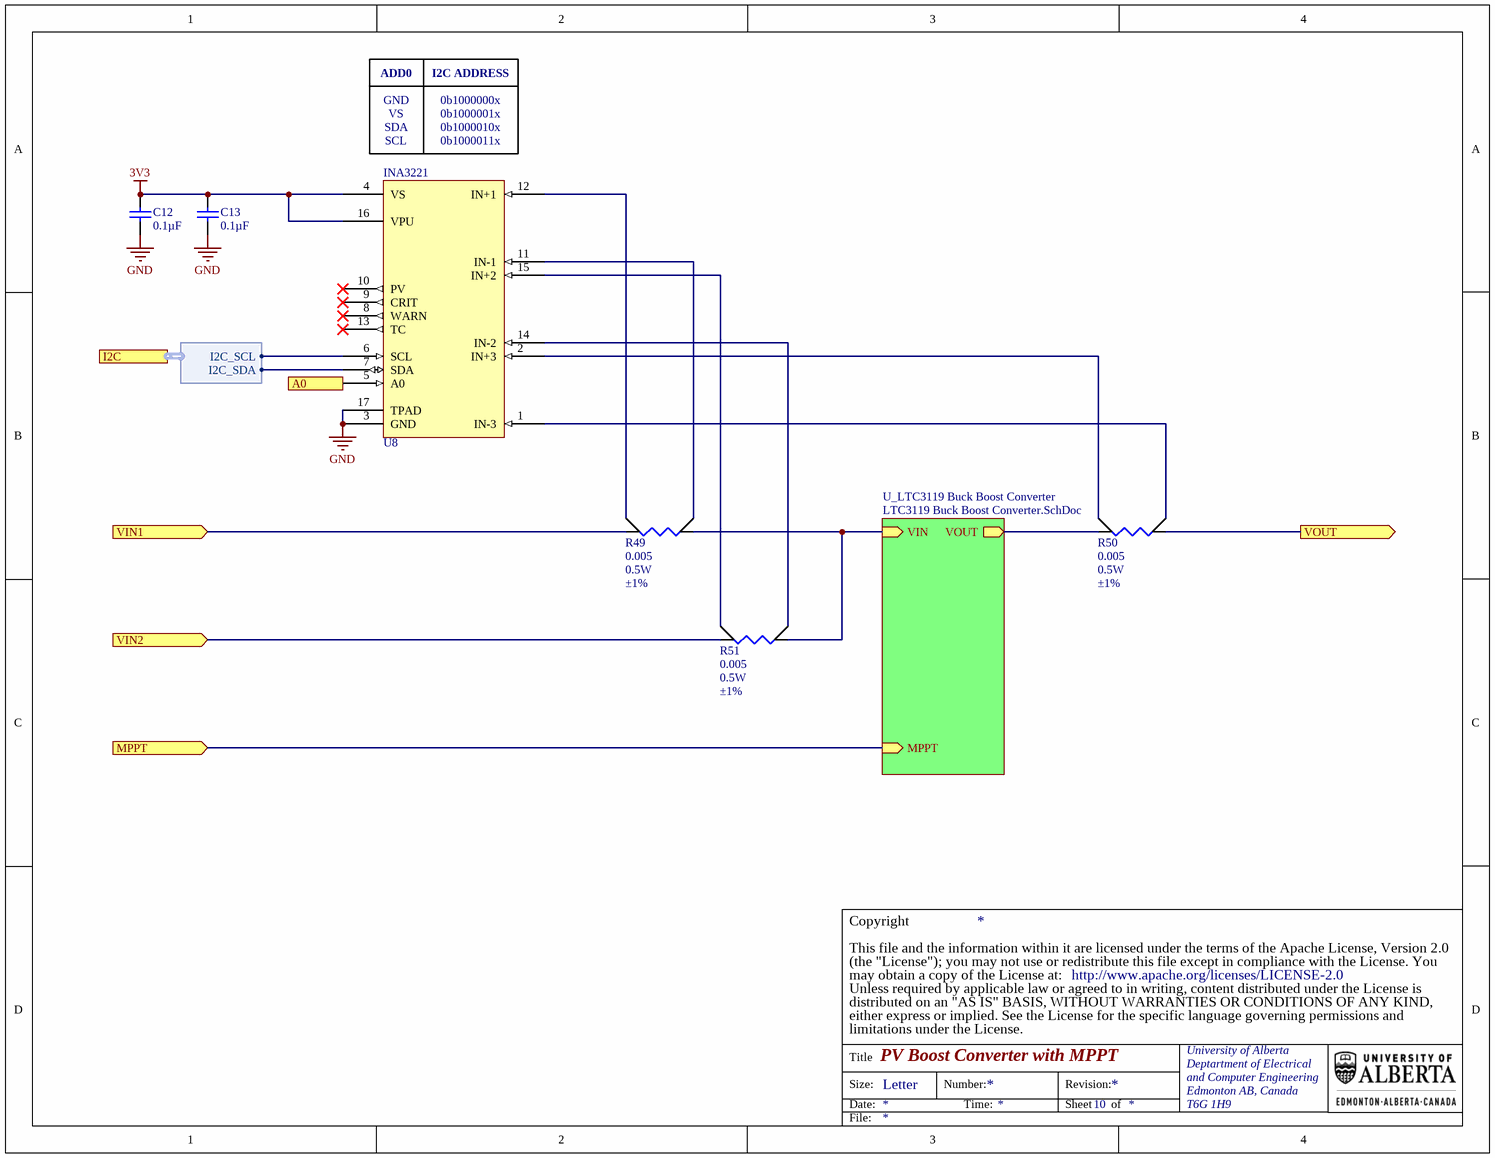
[diagram p16: Solar Power Converter with MPPT.SchDoc]

### Parts
C12  value 0.1µF  [TDK-CGA2B]  (hidden comment: Cap)
C13  value 0.1µF  [TDK-CGA2B]  (hidden comment: Cap)
R49  value 0.005  Power - Rated: 0.5W  Tolerance: ±1%  [BRN-CRF0805]  (hidden comment: Res Sense)
R50  value 0.005  Power - Rated: 0.5W  Tolerance: ±1%  [BRN-CRF0805]  (hidden comment: Res Sense)
R51  value 0.005  Power - Rated: 0.5W  Tolerance: ±1%  [BRN-CRF0805]  (hidden comment: Res Sense)
U8  INA3221  [TI-RGV]

### Sub-sheets
U_LTC3119 Buck Boost Converter = LTC3119 Buck Boost Converter.SchDoc: MPPT (in), VIN (in), VOUT (out)

### Ports
A0 (in), I2C (harness INA3221_I2C), MPPT (in), VIN1 (in), VIN2 (in), VOUT (out)

### Harnesses
INA3221_I2C: I2C_SCL, I2C_SDA

### Nets
3V3: C12.2 C13.2 U8.4(VS) U8.16(VPU)
GND: C12.1 C13.1 U8.3(GND) U8.17(TPAD)
A0: U8.5(A0) ; port A0
MPPT: port MPPT, sheet U_LTC3119 Buck Boost Converter/MPPT
VIN1: R49.2(I2) ; port VIN1
VIN2: R51.2(I2) ; port VIN2
VOUT: R50.1(I1) ; port VOUT
NetR49_1: R49.1(I1) R51.1(I1) ; sheet U_LTC3119 Buck Boost Converter/VIN
NetR49_3: R49.3(S2) U8.12(IN+1)
NetR49_4: R49.4(S1) U8.11(IN-1)
NetR50_2: R50.2(I2) ; sheet U_LTC3119 Buck Boost Converter/VOUT
NetR50_3: R50.3(S2) U8.2(IN+3)
NetR50_4: R50.4(S1) U8.1(IN-3)
NetR51_3: R51.3(S2) U8.15(IN+2)
NetR51_4: R51.4(S1) U8.14(IN-2)
NetU8_6: U8.6(SCL) ; port I2C.I2C_SCL
NetU8_7: U8.7(SDA) ; port I2C.I2C_SDA

Not connected (* = marked no-connect by the designer): U8 8(WARN)* 9(CRIT)* 10(PV)* 13(TC)*

### Channels
U_Solar Power Converter with MPPT1: designators end in _1; ports A0=I2C0.I2C_SDA MPPT=NetQ2_6 VIN1=NetP1_5 VIN2=NetP2_5 VOUT=VBATT
U_Solar Power Converter with MPPT2: designators end in _2; ports A0=I2C0.I2C_SCL MPPT=NetQ2_3 VIN1=NetP3_5 VIN2=NetP4_5 VOUT=VBATT
U_Solar Power Converter with MPPT3: designators end in _3; ports A0=3V3 MPPT=NetQ1_6 VIN1=NetP5_5 VIN2=NetP6_5 VOUT=VBATT
U_Solar Power Converter with MPPT4: designators end in _4; ports A0=GND MPPT=NetQ1_3 VIN1=NetP7_5 VIN2=NetP8_5 VOUT=VBATT

### Notes on the sheet
- ADD0
- GND
- I2C ADDRESS
- 0b1000000x
- VS
- SDA
- (near U8) SCL
- 0b1000001x
- 0b1000010x
- (near U8) 0b1000011x
- (the "License"); you may not use or redistribute this file except in compliance with the License. You
- This file and the information within it are licensed under the terms of the Apache License, Version 2.0
- Copyright
- Unless required by applicable law or agreed to in writing, content distributed under the License is
- distributed on an "AS IS" BASIS, WITHOUT WARRANTIES OR CONDITIONS OF ANY KIND,
- either express or implied. See the License for the specific language governing permissions and
- limitations under the License.
- may obtain a copy of the License at:
- http://www.apache.org/licenses/LICENSE-2.0
- Title
- Size:
- Date:
- Letter
- Number:
- Time:
- Revision:
- Sheet
- of
- University of Alberta
- Deptartment of Electrical
- and Computer Engineering
- Edmonton AB, Canada
- T6G 1H9
- File:

### Library data of the parts
C12 C13 = PC-TDK-02259: as C14 on sheet MAX16998A Watchdog Circuit; Published: 2016-03-16; LatestRevisionDate: 2016-03-16; LatestRevisionNote: ...; PackageReference: 0402 (1005 Metric); Publisher: AlbertaSat; PackageDescription: Radial Cap, Thru-Hole; 2 Leads; 0.3 in Pin Spacing; Part Number: PC-TDK-02259; Supplier Part Number 1: 445-6899-1-ND; Supplier 1: Digi-key; Supplier Link: http://www.digikey.ca/product-search/en?keywords=445-6899-1-ND; Voltage - Rated: 50V; Temperature Coefficient: X7R; Applications: Automotive; Operating Temperature: -55°C ~ 125°C
R49-R51 = PR-BRN-00023: as R56 on sheet INA226 Current Sensor; Part Number: PR-BRN-00023; Supplier Part Number 1: CRF0805-FZ-R005ELFCT-ND; Supplier 1: Digi-key; Supplier Part Number 2: 652-CRF0805FZR005ELF; Supplier 2: Mouser; Publisher: AlbertaSat; Published: 2022-11-26; LatestRevisionDate: 2023-05-04; LatestRevisionNote: Added operating temperature; PackageReference: BRN-CRF0805; Supplier Link: #https://www.digikey.ca/en/products/detail/bourns-inc/CRF0805-FZ-R005ELF/6210977#; Operating Temperature: -55°C ~ 170°C
U8 = 39: IC CURRENT SHUNT MONITOR 16VQFN; Part Number: 39; Manufacturer Part Number: INA3221AQRGVRQ1; Designator: U?; Supplier Part Number 1: 296-INA3221AQRGVRQ1CT-ND; Supplier 1: Digi-Key; Supplier Link: #https://www.digikey.ca/en/products/detail/texas-instruments/INA3221AQRGVRQ1/5995432#; PackageReference: TI-VQFN16; Operating Temperature: -40°C ~ 125°C